# EAGLE schematic max232 (EAGLE 7.3.0)
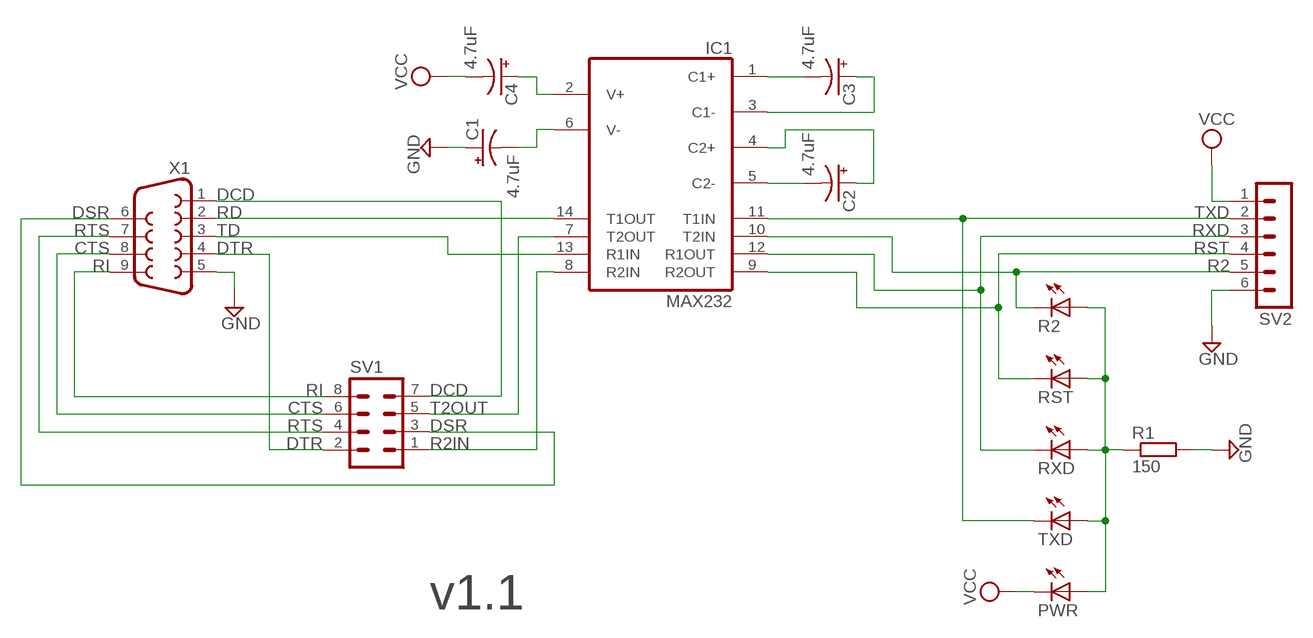
[diagram p0: schematic, sheet 1]

## Parts
C1  4.7uF  CPOL-USE2-4  [E2-4]
C2  4.7uF  CPOL-USE2-4  [E2-4]
C3  4.7uF  CPOL-USE2-4  [E2-4]
C4  4.7uF  CPOL-USE2-4  [E2-4]
IC1  MAX232  [DIL16]
PWR  LED3MM  [LED3MM]
R1  150  R-EU_0207/10  [0207/10]
R2  LED3MM  [LED3MM]
RST  LED3MM  [LED3MM]
RXD  LED3MM  [LED3MM]
SV1  MA04-2  [MA04-2]
SV2  MA06-1  [MA06-1]
TXD  LED3MM  [LED3MM]
X1  F09HP  [F09HP]

## Nets
CTS: SV1.6 X1.8
DCD: SV1.7 X1.1
DSR: SV1.3 X1.6
DTR: SV1.2 X1.4
GND: C1.+ R1.2 SV2.6 X1.5
N$2: C3.+ IC1.3(C1-)
N$3: C3.- IC1.1(C1+)
N$11: PWR.A R1.1 R2.A RST.A RXD.A TXD.A
N$18: C4.+ IC1.2(V+)
N$19: C1.- IC1.6(V-)
N$20: C2.- IC1.5(C2-)
N$21: C2.+ IC1.4(C2+)
R2: IC1.10(T2IN) R2.K(C) SV2.5
R2IN/RST: IC1.8(R2IN) SV1.1
RD: IC1.14(T1OUT) X1.2
RI: SV1.8 X1.9
RST: IC1.9(R2OUT) RST.K(C) SV2.4
RTS: SV1.4 X1.7
RXD: IC1.12(R1OUT) RXD.K(C) SV2.3
T2OUT: IC1.7(T2OUT) SV1.5
TD: IC1.13(R1IN) X1.3
TXD: IC1.11(T1IN) SV2.2 TXD.K(C)
VCC: C4.- PWR.K(C) SV2.1

## Notes on the sheet
- v1.1

## Power pins joined to a net without a drawn wire
GND: IC1.15(GND)
VCC: IC1.16(VCC)

## Library data of the parts
C1-C4 = rcl:CPOL-US: POLARIZED CAPACITOR, American symbol
IC1 = maxim:MAX232: RS232 TRANSCEIVER; MF: MAXIM; MPN: MAX232ACPE+; OC_FARNELL: 9723773; OC_NEWARK: 68K4544
PWR R2 RST RXD TXD = led:LED: LED OSRAM: - CHIPLED LG R971, LG N971, LY N971, LG Q971, LY Q971, LO R971, LY R971 LH N974, LH R974 LS Q976, LO Q976, LY Q976 LO Q996 - Hyper CHIPLED LW Q18S LB Q993, LB Q99A, LB R99A - SideLED LS A670, LO A670, LY A670, LG A670, LP A670 LB A673, LV A673, LT A673, LW A673 LH A674 LY A675 LS A676, LA A676, LO A676, LY A676, LW A676 LS A679, LY A679, LG A679 - Hyper Micro SIDELED® LS Y876, LA Y876, LO Y876, LY Y876 LT Y87S - SmartLED LW L88C, LW L88S LB L89C, LB L89S, LG L890 LS L89K, LO L89K, LY L89K LS L896, LA L896, LO L896, LY L896 - TOPLED LS T670, LO T670, LY T670, LG T670, LP T670 LSG T670, LSP T670, LSY T670, LOP T670, LYG T670 LG T671, LOG T671, LSG T671 LB T673, LV T673, LT T673, LW T673 LH T674 LS T676, LA T676, LO T676, LY T676, LB T676, LH T676, LSB T676, LW T676 LB T67C, LV T67C, LT T67C, LS T67K, LO T67K, LY T67K, LW E67C LS E67B, LA E67B, LO E67B, LY E67B, LB E67C, LV E67C, LT E67C LW T67C LS T679, LY T679, LG T679 LS T770, LO T770, LY T770, LG T770, LP T770 LB T773, LV T773, LT T773, LW T773 LH T774 LS E675, LA E675, LY E675, LS T675 LS T776, LA T776, LO T776, LY T776, LB T776 LHGB T686 LT T68C, LB T68C - Hyper Mini TOPLED® LB M676 - Mini TOPLED Santana® LG M470 LS M47K, LO M47K, LY M47K Source: http://www.osram.convergy.de LUXEON: - LUMILED® LXK2-PW12-R00, LXK2-PW12-S00, LXK2-PW14-U00, LXK2-PW14-V00 LXK2-PM12-R00, LXK2-PM12-S00, LXK2-PM14-U00 LXK2-PE12-Q00, LXK2-PE12-R00, LXK2-PE12-S00, LXK2-PE14-T00, LXK2-PE14-U00 LXK2-PB12-K00, LXK2-PB12-L00, LXK2-PB12-M00, LXK2-PB14-N00, LXK2-PB14-P00, LXK2-PB14-Q00 LXK2-PR12-L00, LXK2-PR12-M00, LXK2-PR14-Q00, LXK2-PR14-R00 LXK2-PD12-Q00, LXK2-PD12-R00, LXK2-PD12-S00 LXK2-PH12-R00, LXK2-PH12-S00 LXK2-PL12-P00, LXK2-PL12-Q00, LXK2-PL12-R00 Source: www.luxeon.com KINGBRIGHT: KA-3528ASYC Source: www.kingbright.com
R1 = rcl:R-EU_: RESISTOR, European symbol
SV1 = con-lstb:MA04-2: PIN HEADER; OC_FARNELL: unknown; OC_NEWARK: unknown
SV2 = con-lstb:MA06-1: PIN HEADER; OC_FARNELL: unknown; OC_NEWARK: unknown
X1 = con-subd:F09: SUB-D; OC_FARNELL: unknown; OC_NEWARK: unknown